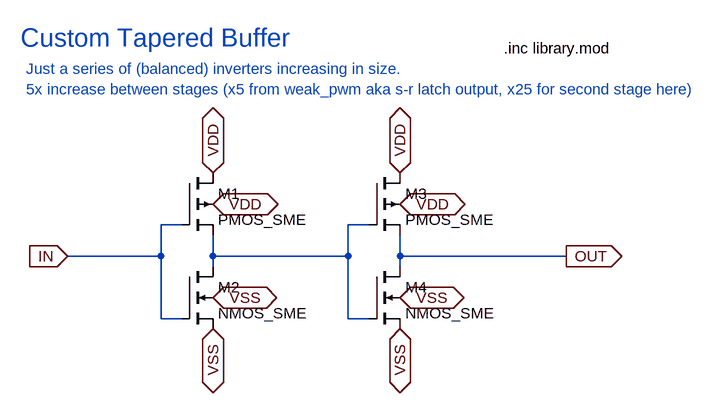
[diagram p0: schematic my_tapered_buffer.asc]
my_tapered_buffer.asc, the LTspice schematic file:
Version 4.1
SHEET 1 1252 732
WIRE 112 336 80 336
WIRE 400 336 368 336
WIRE 80 384 80 336
WIRE 80 384 -64 384
WIRE 160 384 160 352
WIRE 368 384 368 336
WIRE 368 384 160 384
WIRE 448 384 448 352
WIRE 704 384 448 384
WIRE 160 400 160 384
WIRE 448 400 448 384
WIRE 80 480 80 384
WIRE 112 480 80 480
WIRE 368 480 368 384
WIRE 400 480 368 480
FLAG -64 384 IN
IOPIN -64 384 In
FLAG 704 384 OUT
IOPIN 704 384 Out
FLAG 160 256 VDD
IOPIN 160 256 BiDir
FLAG 160 304 VDD
IOPIN 160 304 BiDir
FLAG 160 496 VSS
IOPIN 160 496 BiDir
FLAG 160 448 VSS
IOPIN 160 448 BiDir
FLAG 448 496 VSS
IOPIN 448 496 BiDir
FLAG 448 448 VSS
IOPIN 448 448 BiDir
FLAG 448 304 VDD
IOPIN 448 304 BiDir
FLAG 448 256 VDD
IOPIN 448 256 BiDir
SYMBOL pmos4 112 256 R0
SYMATTR InstName M1
SYMATTR Value PMOS_SME
SYMATTR Value2 l=0.35u w=5u
SYMBOL nmos4 112 400 R0
SYMATTR InstName M2
SYMATTR Value NMOS_SME
SYMATTR Value2 l=0.35u w=2u
SYMBOL pmos4 400 256 R0
SYMATTR InstName M3
SYMATTR Value PMOS_SME
SYMATTR Value2 l=0.35u w=25u
SYMBOL nmos4 400 400 R0
SYMATTR InstName M4
SYMATTR Value NMOS_SME
SYMATTR Value2 l=0.35u w=10u
TEXT -136 48 Left 4 ;Custom Tapered Buffer
TEXT 608 64 Left 2 !.inc library.mod
TEXT -128 96 Left 2 ;Just a series of (balanced) inverters increasing in size.\n5x increase between stages (x5 from weak_pwm aka s-r latch output, x25 for second stage here)

The netlist it stands for:
* my_tapered_buffer.asc
M1 VDD IN N001 VDD PMOS_SME l=0.35u w=5u
M2 N001 IN VSS VSS NMOS_SME l=0.35u w=2u
M3 VDD N001 OUT VDD PMOS_SME l=0.35u w=25u
M4 OUT N001 VSS VSS NMOS_SME l=0.35u w=10u
.model NMOS NMOS
.model PMOS PMOS
.lib standard.mos
* Custom Tapered Buffer
.inc library.mod
* Just a series of (balanced) inverters increasing in size.
* 5x increase between stages (x5 from weak_pwm aka s-r latch output, x25 for second stage here)
.backanno
.end